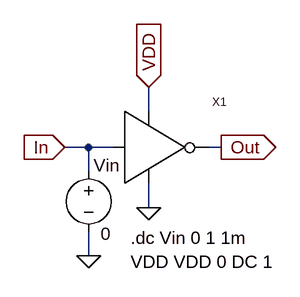
[diagram p0: schematic Inverter_Sim_1.asc]
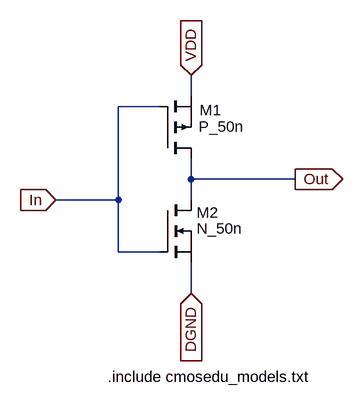
[diagram p1: sub-circuit inverter.asc]
Inverter_Sim_1.asc, the LTspice schematic file:
Version 4
SHEET 1 1024 680
WIRE 128 -592 128 -624
WIRE 48 -544 16 -544
WIRE 80 -544 48 -544
WIRE 224 -544 208 -544
WIRE 48 -512 48 -544
WIRE 128 -464 128 -496
WIRE 48 -400 48 -432
FLAG 128 -464 0
FLAG 224 -544 Out
IOPIN 224 -544 Out
FLAG 128 -624 VDD
IOPIN 128 -624 In
FLAG 16 -544 In
IOPIN 16 -544 In
FLAG 48 -400 0
SYMBOL voltage 48 -528 R0
WINDOW 0 7 8 Left 2
WINDOW 3 16 99 Left 2
SYMATTR InstName Vin
SYMATTR Value 0
SYMBOL Inverter 96 -544 R0
SYMATTR InstName X1
TEXT 104 -424 Left 2 !.dc Vin 0 1 1m
TEXT 104 -392 Left 2 !VDD VDD 0 DC 1

inverter.asc, the sub-circuit schematic file:
Version 4
SHEET 1 1024 680
WIRE 128 -672 128 -704
WIRE 80 -656 16 -656
WIRE 128 -544 128 -576
WIRE 288 -544 128 -544
WIRE 16 -512 16 -656
WIRE 16 -512 -80 -512
WIRE 128 -512 128 -544
WIRE 16 -432 16 -512
WIRE 80 -432 16 -432
WIRE 128 -368 128 -416
FLAG 288 -544 Out
IOPIN 288 -544 Out
FLAG 128 -704 VDD
IOPIN 128 -704 In
FLAG -80 -512 In
IOPIN -80 -512 In
FLAG 128 -368 DGND
IOPIN 128 -368 In
SYMBOL nmos 80 -512 R0
WINDOW 3 57 44 Left 2
WINDOW 0 57 19 Left 2
SYMATTR Value N_50n
SYMATTR InstName M2
SYMBOL pmos 80 -576 M180
WINDOW 3 60 49 Left 2
WINDOW 0 61 74 Left 2
SYMATTR Value P_50n
SYMATTR InstName M1
TEXT 0 -240 Left 2 !.include cmosedu_models.txt

The netlist it stands for:
* Inverter_Sim_1.asc
Vin In 0 0
XX1 In VDD 0 Out inverter

* block symbol definitions
.subckt inverter In VDD DGND Out
M2 Out In DGND DGND N_50n
M1 Out In VDD VDD P_50n
.include cmosedu_models.txt
.ends inverter

.model NMOS NMOS
.model PMOS PMOS
.lib standard.mos
.dc Vin 0 1 1m
VDD VDD 0 DC 1
.backanno
.end